# Altium schematic sheet Switch sheet.SchDoc: Reset, Boot and control switchs
size A; DrawnBy: Mr.Farhad Jafari; Engineer: Mr.Farhad Jafari; Address1: www.BasetP.com; Address2: www.BasetP.com; Address3: www.BasetP.com; Address4: www.BasetP.com; Revision: V1.1; SheetNumber: 4; SheetTotal: 5; ProjectName: Humanoid robot
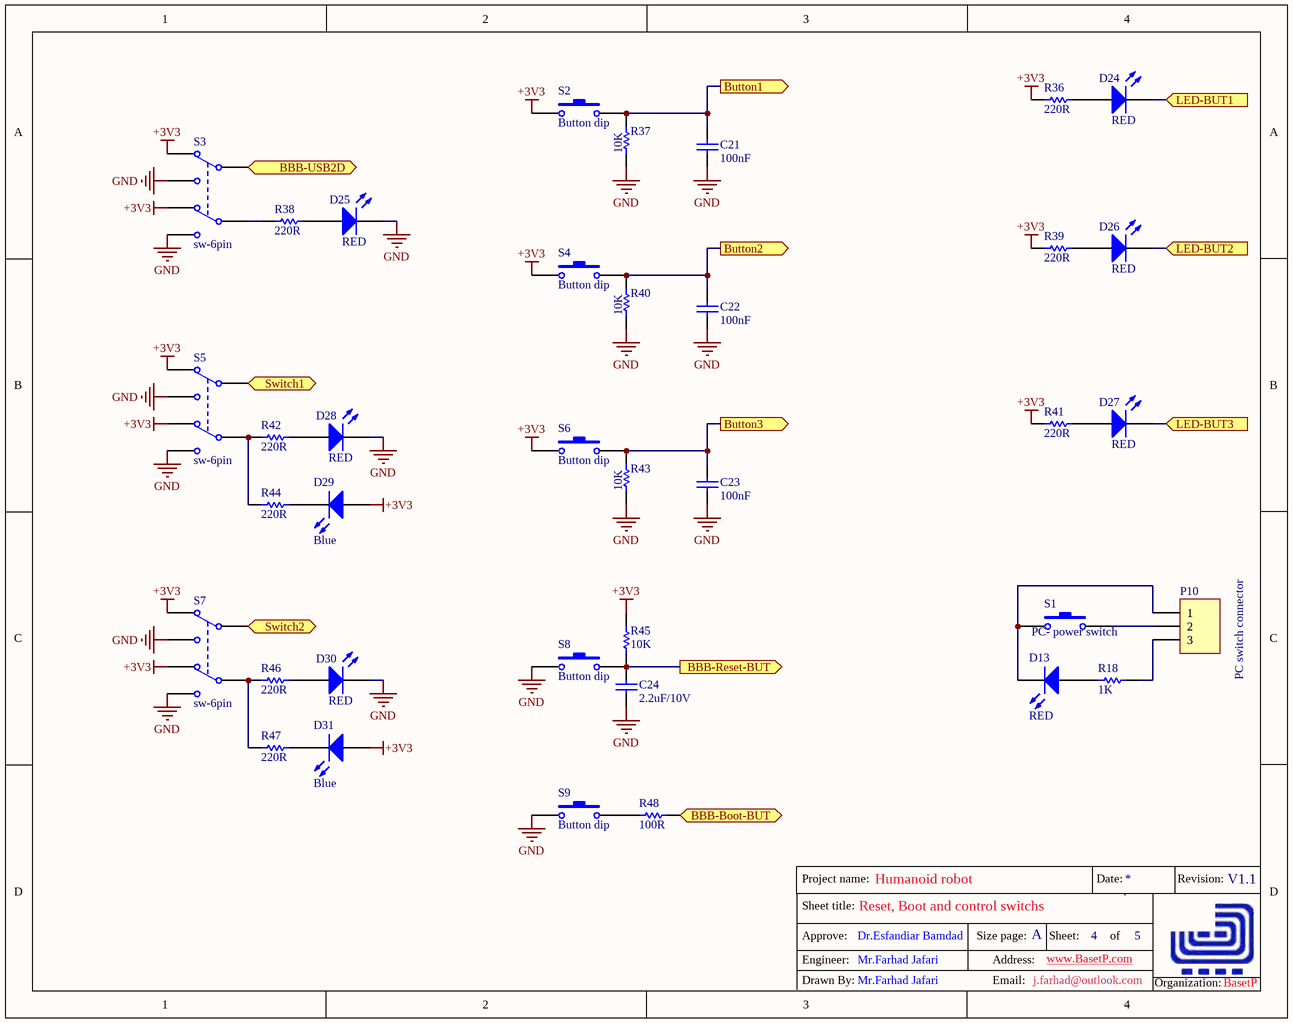
[diagram p0: Switch sheet.SchDoc]

## Parts
C21  value 100nF  [0805]  (hidden comment: C0805)
C22  value 100nF  [0805]  (hidden comment: C0805)
C23  value 100nF  [0805]  (hidden comment: C0805)
C24  value 2.2uF/10V  [0805]  (hidden comment: C0805)
D13  RED  [LED Red-0805]
D24  RED  [LED Red-0805]
D25  RED  [LED Red-0805]
D26  RED  [LED Red-0805]
D27  RED  [LED Red-0805]
D28  RED  [LED Red-0805]
D29  Blue  [led Blue-0805]
D30  RED  [LED Red-0805]
D31  Blue  [led Blue-0805]
P10  PC switch connector  [HDR1X3]
R18  1K  [6-0805]
R36  220R  [6-0805]
R37  10K  [6-0805]
R38  220R  [6-0805]
R39  220R  [6-0805]
R40  10K  [6-0805]
R41  220R  [6-0805]
R42  220R  [6-0805]
R43  10K  [6-0805]
R44  220R  [6-0805]
R45  10K  [6-0805]
R46  220R  [6-0805]
R47  220R  [6-0805]
R48  100R  [6-0805]
S1  PC- power switch  [DTS-6x]
S2  Button dip  [DTS-6x]
S3  sw-6pin  [sw-6pin]
S4  Button dip  [DTS-6x]
S5  sw-6pin  [sw-6pin]
S6  Button dip  [DTS-6x]
S7  sw-6pin  [sw-6pin]
S8  Button dip  [DTS-6x]
S9  Button dip  [DTS-6x]

## Ports
BBB-Boot-BUT (out), BBB-Reset-BUT (out), BBB-USB2D (out), Button1 (out), Button2 (out), Button3 (out), LED-BUT1 (in), LED-BUT2 (in), LED-BUT3 (in), Switch1 (out), Switch2 (out)

## Nets
+3V3: D29.1(A) D31.1(A) R36.1 R39.1 R41.1 R45.2 S2.1 S3.1(NC1) S3.6(NC2) S4.1 S5.1(NC1) S5.6(NC2) S6.1 S7.1(NC1) S7.6(NC2)
GND: C21.1 C22.1 C23.1 C24.1 D25.2(K) D28.2(K) D30.2(K) R37.1 R40.1 R43.1 S3.3(NO1) S3.4(NO2) S5.3(NO1) S5.4(NO2) S7.3(NO1) S7.4(NO2) S8.1 S9.1
BBB-Boot-BUT: R48.1 ; port BBB-Boot-BUT
BBB-Reset-BUT: C24.2 R45.1 S8.2 ; port BBB-Reset-BUT
BBB-USB2D: S3.2(COMMON1) ; port BBB-USB2D
Button1: C21.2 R37.2 S2.2 ; port Button1
Button2: C22.2 R40.2 S4.2 ; port Button2
Button3: C23.2 R43.2 S6.2 ; port Button3
LED-BUT1: D24.2(K) ; port LED-BUT1
LED-BUT2: D26.2(K) ; port LED-BUT2
LED-BUT3: D27.2(K) ; port LED-BUT3
Switch1: S5.2(COMMON1) ; port Switch1
Switch2: S7.2(COMMON1) ; port Switch2
NetD13_1: D13.1(A) R18.2
NetD13_2: D13.2(K) P10.1 S1.1
NetD24_1: D24.1(A) R36.2
NetD25_1: D25.1(A) R38.2
NetD26_1: D26.1(A) R39.2
NetD27_1: D27.1(A) R41.2
NetD28_1: D28.1(A) R42.2
NetD29_2: D29.2(K) R44.2
NetD30_1: D30.1(A) R46.2
NetD31_2: D31.2(K) R47.2
NetP10_2: P10.2 S1.2
NetP10_3: P10.3 R18.1
NetR38_1: R38.1 S3.5(COMMON2)
NetR42_1: R42.1 R44.1 S5.5(COMMON2)
NetR46_1: R46.1 R47.1 S7.5(COMMON2)
NetR48_2: R48.2 S9.2

## Notes on the sheet
- Sheet title:
- Project name:
- Date:
- Revision:
- Engineer:
- Approve:
- Dr.Esfandiar Bamdad
- Size page:
- Address:
- A
- www.BasetP.com
- Sheet:
- of
- Drawn By:
- Mr.Farhad Jafari
- Email:
- j.farhad@outlook.com
- Organization:
- BasetP

## Library data of the parts
C21-C24 = C0805: Ceramic Chip Capacitor - Standard; Note: Footprint corresponds to dimensions for bulk cassette packaging. This case size has tightened tolerances.; Published: 17-Jul-2002; LatestRevisionDate: 19-Mar-2004; LatestRevisionNote: Silkscreen size reduced.; DatasheetDocument: Mar-2001; PackageDocument: Mar-2001; PackageReference: 0805; Publisher: Altium Limited; Code_JEITA: 0805; Code_IPC: 2012[0805]; ComponentLink1Description: Manufacturer Link; ComponentLink1URL: http://www.kemet.com/; ComponentLink2Description: Datasheet; ComponentLink2URL: http://www.kemet.com/kemet/web/homepage/kechome.nsf/vapubfilesname/F3102TA.pdf/$file/F3102TA.pdf
D13 D24-D28 D30 = LED-RED: High Performance Chip LED, Amber; LuminousIntensity: 25mcd (Minimum).; PCB_Layout: Complies with manufacturer's recommendation.; Published: 11-Dec-2002; PackageReference: 2.0X1.25X0.8; Publisher: Altium Limited; LED_Colour: Amber; ComponentLink1Description: Manufacturer Link; ComponentLink1URL: http://www.agilent.com/; ComponentLink2Description: Datasheet; ComponentLink2URL: http://cp.literature.agilent.com/litweb/pdf/5988-5891EN.pdf; DatasheetDocument: 11-Mar-2002; PackageDocument: 29-Oct-2001
D29 D31 = LED-BLUE: High Performance Chip LED, Amber; LuminousIntensity: 25mcd (Minimum).; PCB_Layout: Complies with manufacturer's recommendation.; Published: 11-Dec-2002; DatasheetDocument: 11-Mar-2002; PackageDocument: 29-Oct-2001; PackageReference: 2.0X1.25X0.8; Publisher: Altium Limited; LED_Colour: Amber; ComponentLink1Description: Manufacturer Link; ComponentLink1URL: http://www.agilent.com/; ComponentLink2Description: Datasheet; ComponentLink2URL: http://cp.literature.agilent.com/litweb/pdf/5988-5891EN.pdf
P10 = Header 3: Header, 3-Pin; LatestRevisionDate: 17-Jul-2002; LatestRevisionNote: Re-released for DXP Platform.; Publisher: Altium Limited
R18 R36-R48 = ERJ6RS: Low Ohmic Value Thick Film Chip Resistor, 0.1 Ohm to 0.2 Ohm Range, 1%, 2% and 5% Tolerance, 0805 Size, 0.125 W; Published: 17-Dec-2003; LatestRevisionDate: 19-Mar-2004; LatestRevisionNote: Silkscreen size reduced.; PackageDocument: Mar-2003; PackageReference: 6-0805; Publisher: Altium Limited; Code_IPC: 2012 [0805]; ComponentLink1Description: Manufacturer Link; ComponentLink1URL: http://www.panasonic.com/industrial/components/resistive_products.htm; ComponentLink2Description: Datasheet; ComponentLink2URL: http://www.panasonic.com/industrial/components/pdf/AOA0000CE3.pdf
S1 S2 S4 S6 S8 S9 = Button dip: Switch